# EasyEDA schematic SCH_charge.json
TITLE: Sheet_1; REV: 1.0; Date: 2020-02-24; Sheet: 1/1; Drawn By: kaixuan; Company: Your Company
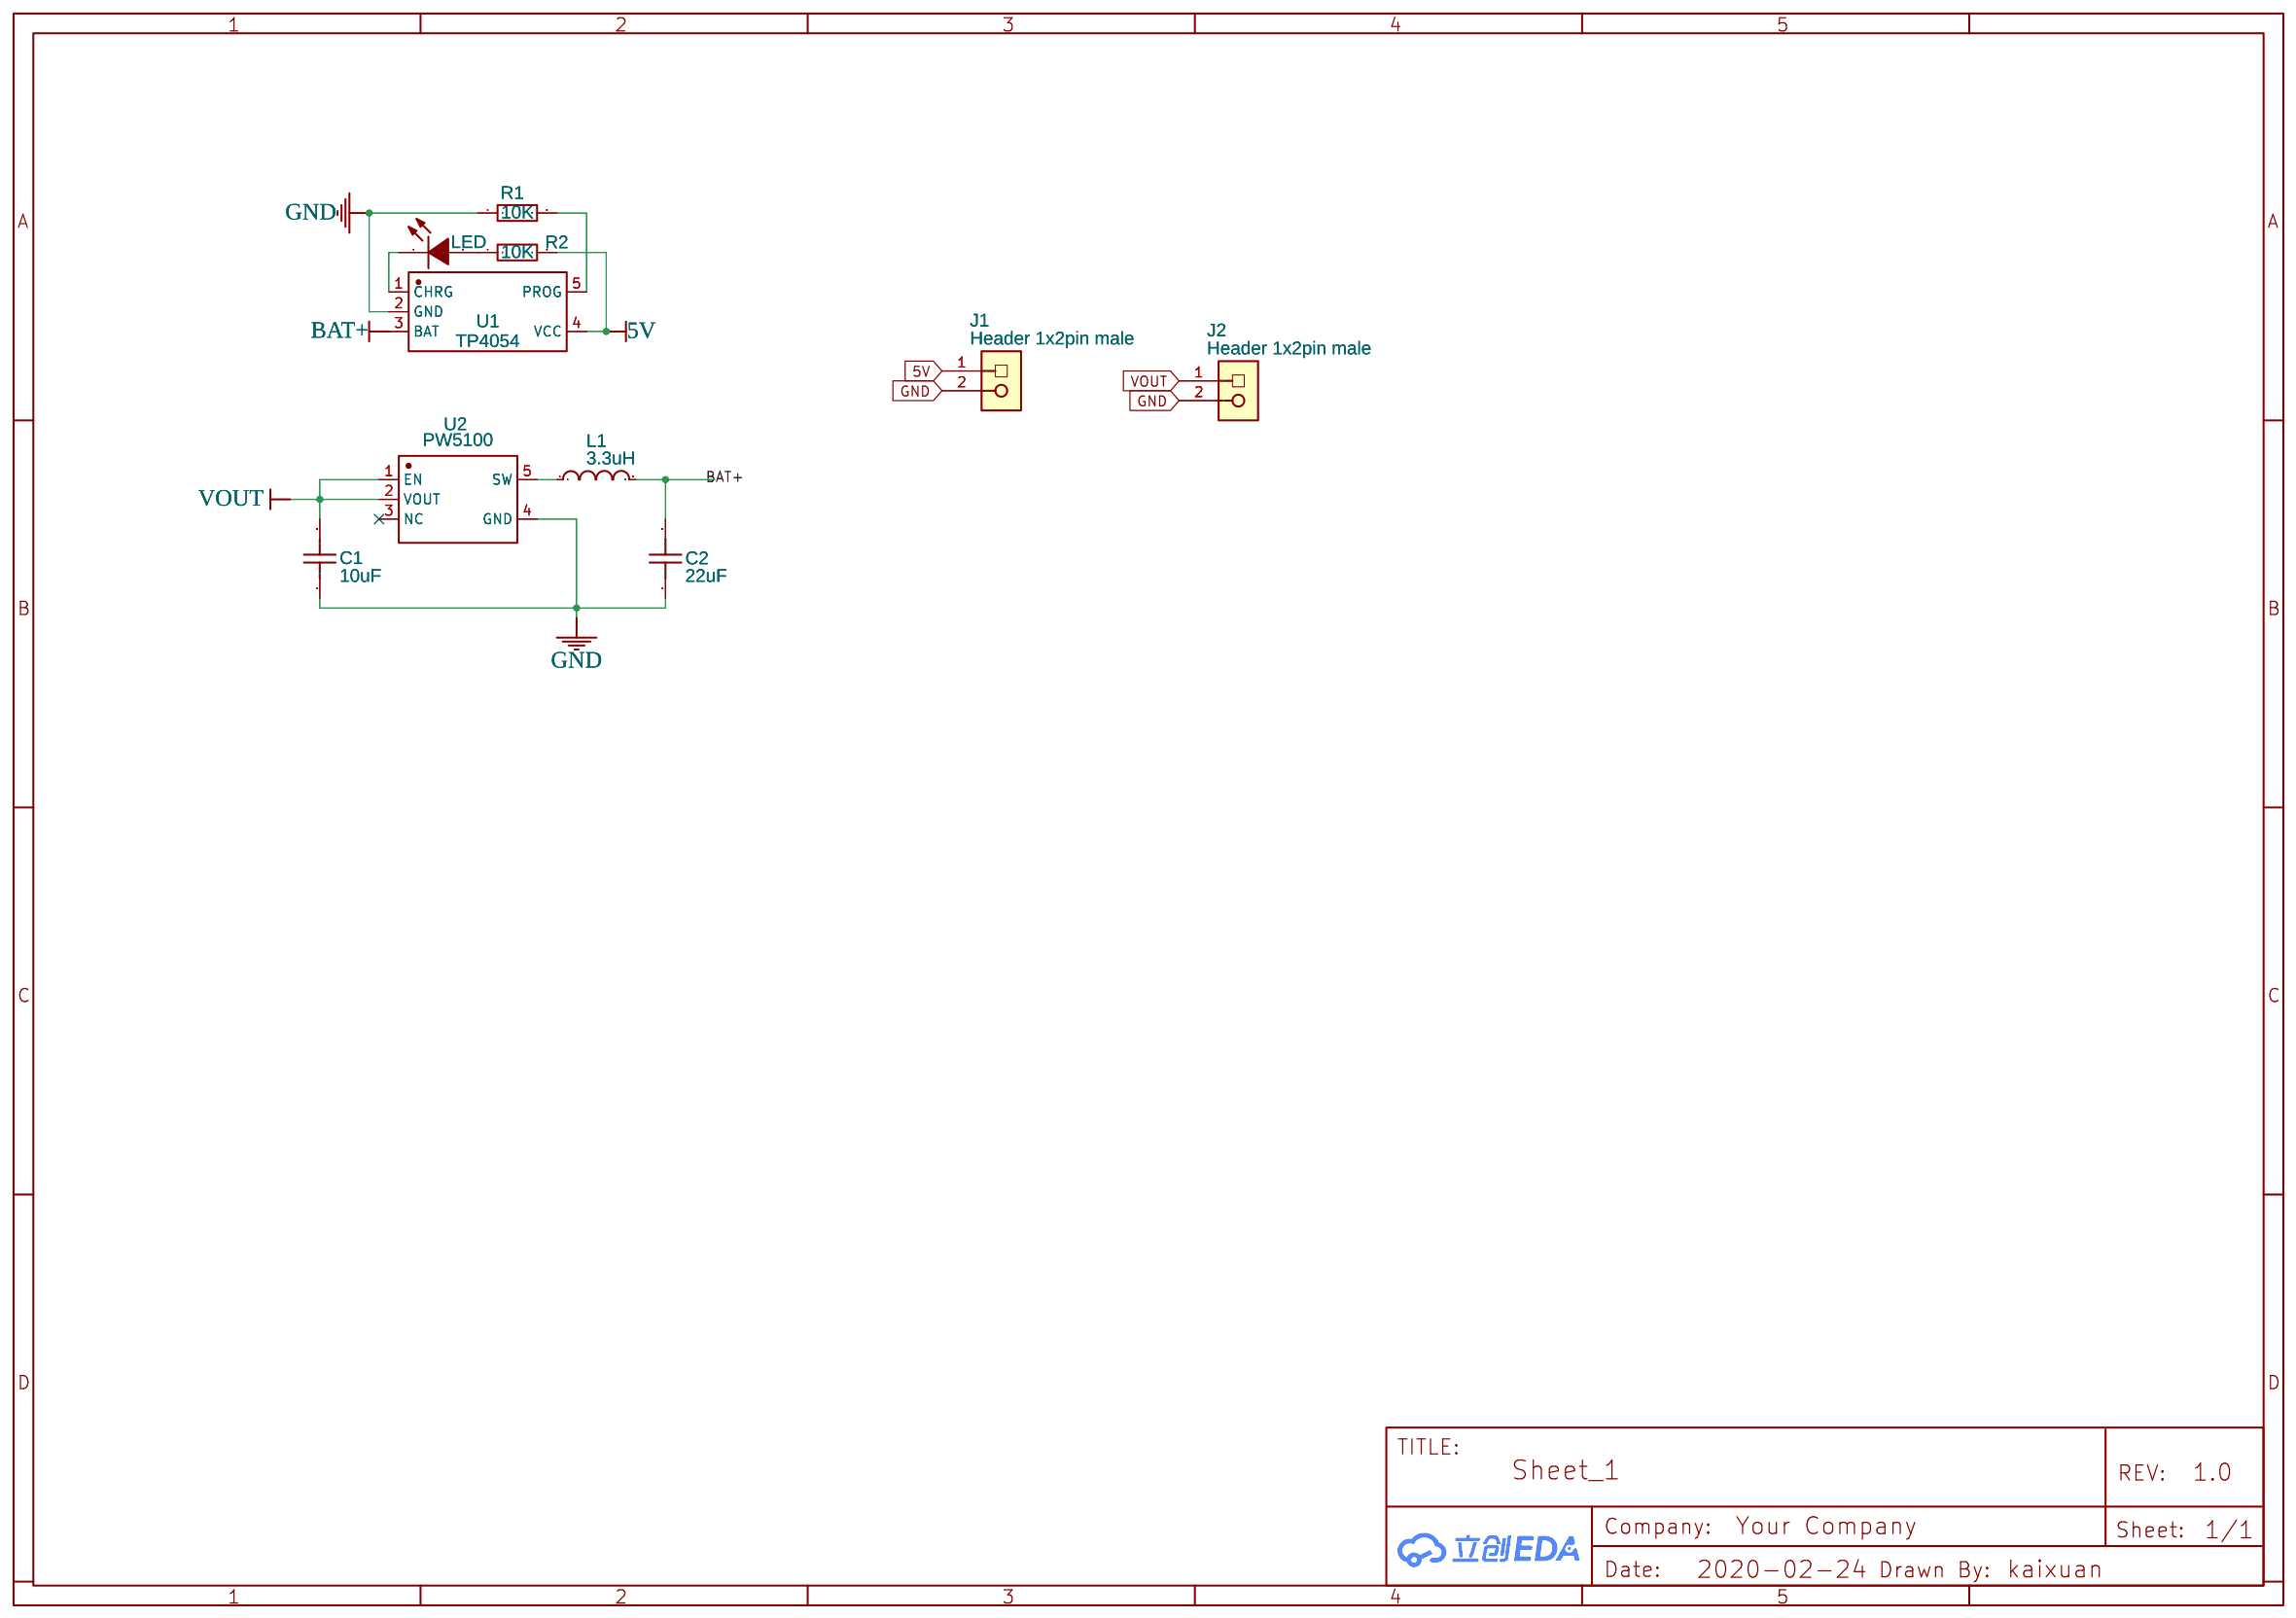
[diagram p0: schematic sheet]

## Parts
C1  10uF  [C0603]
C2  22uF  [C0603]
J1  Header 1x2pin male  [HEADER-2.54/1X2PIN]
J2  Header 1x2pin male  [HEADER-2.54/1X2PIN]
L1  3.3uH  [L0805]
LED1  LED  [LED0402-RD]
R1  10K  [R0603]
R2  10K  [R0603]
U1  TP4054  [SOT-23-5_L3.0-W1.7-P0.95-LS2.8-BR]
U2  PW5100  [SOT-23-5_L3.0-W1.7-P0.95-LS2.8-BR]

## Library data of the parts
C1 = CL10A106MA8NRNC: Supplier: LCSC; Manufacturer: SAMSUNG; Supplier Part: C96446; SMT Type: Extend; JLCPCB SMD: Yes
C2 = CL10A226MQ8NRNC: Supplier: LCSC; Manufacturer: SAMSUNG; Supplier Part: C59461; SMT Type: Basic; JLCPCB SMD: Yes
J1 J2 = Header 1x2pin male: Manufacturer: Molex; Contributor: y123s2009
L1 = LVF252A12-3R3M-N: Supplier: LCSC; Manufacturer: Chilisin; Supplier Part: C142155; JLCPCB SMD: Yes; SMT Type: Extend
LED1 = FC-F1005UGK-520M5: Supplier: LCSC; Manufacturer: NATIONSTAR; Contributor: LCSC; Supplier Part: C130723; JLCPCB Part Class: Extended Part
R1 R2 = RC0402FR-0710KL: Supplier: LCSC; Manufacturer: YAGEO; Supplier Part: C25744; JLCPCB Part Class: Extended Part
U1 = TP4054: sourceId: dx642CAWU; Contributor: kyle.hu.gz; Supplier: LCSC; Manufacturer: TOPPOWER; Supplier Part: C32574; JLCPCB Part Class: Basic Part
U2 = PW5100: Supplier: 平芯微; Manufacturer: PWmicro; Contributor: 小叮智能科技; SMT Type: Extend; JLCPCB SMD: Yes; link: https://www.pwchip.com/product/PW5100-51.html

## Nets
5V: J1.1 R2.2 U1.4(VCC)
GND: C1.1 C2.1 J1.2 J2.2 R1.1 U1.2(GND) U2.4(GND)
BAT+: C2.2 L1.2 U1.3(BAT)
VOUT: C1.2 J2.1 U2.1(EN) U2.2(VOUT)
Net-(L1-1): L1.1 U2.5(SW)
Net-(LED1-1): LED1.1(K) U1.1(CHRG)
Net-(LED1-2): LED1.2(A) R2.1
Net-(R1-2): R1.2 U1.5(PROG)

Not connected (* = marked no-connect by the designer): U2 3(NC)*
